# Altium schematic sheet StationSolPortative.SchDoc
size Tabloid
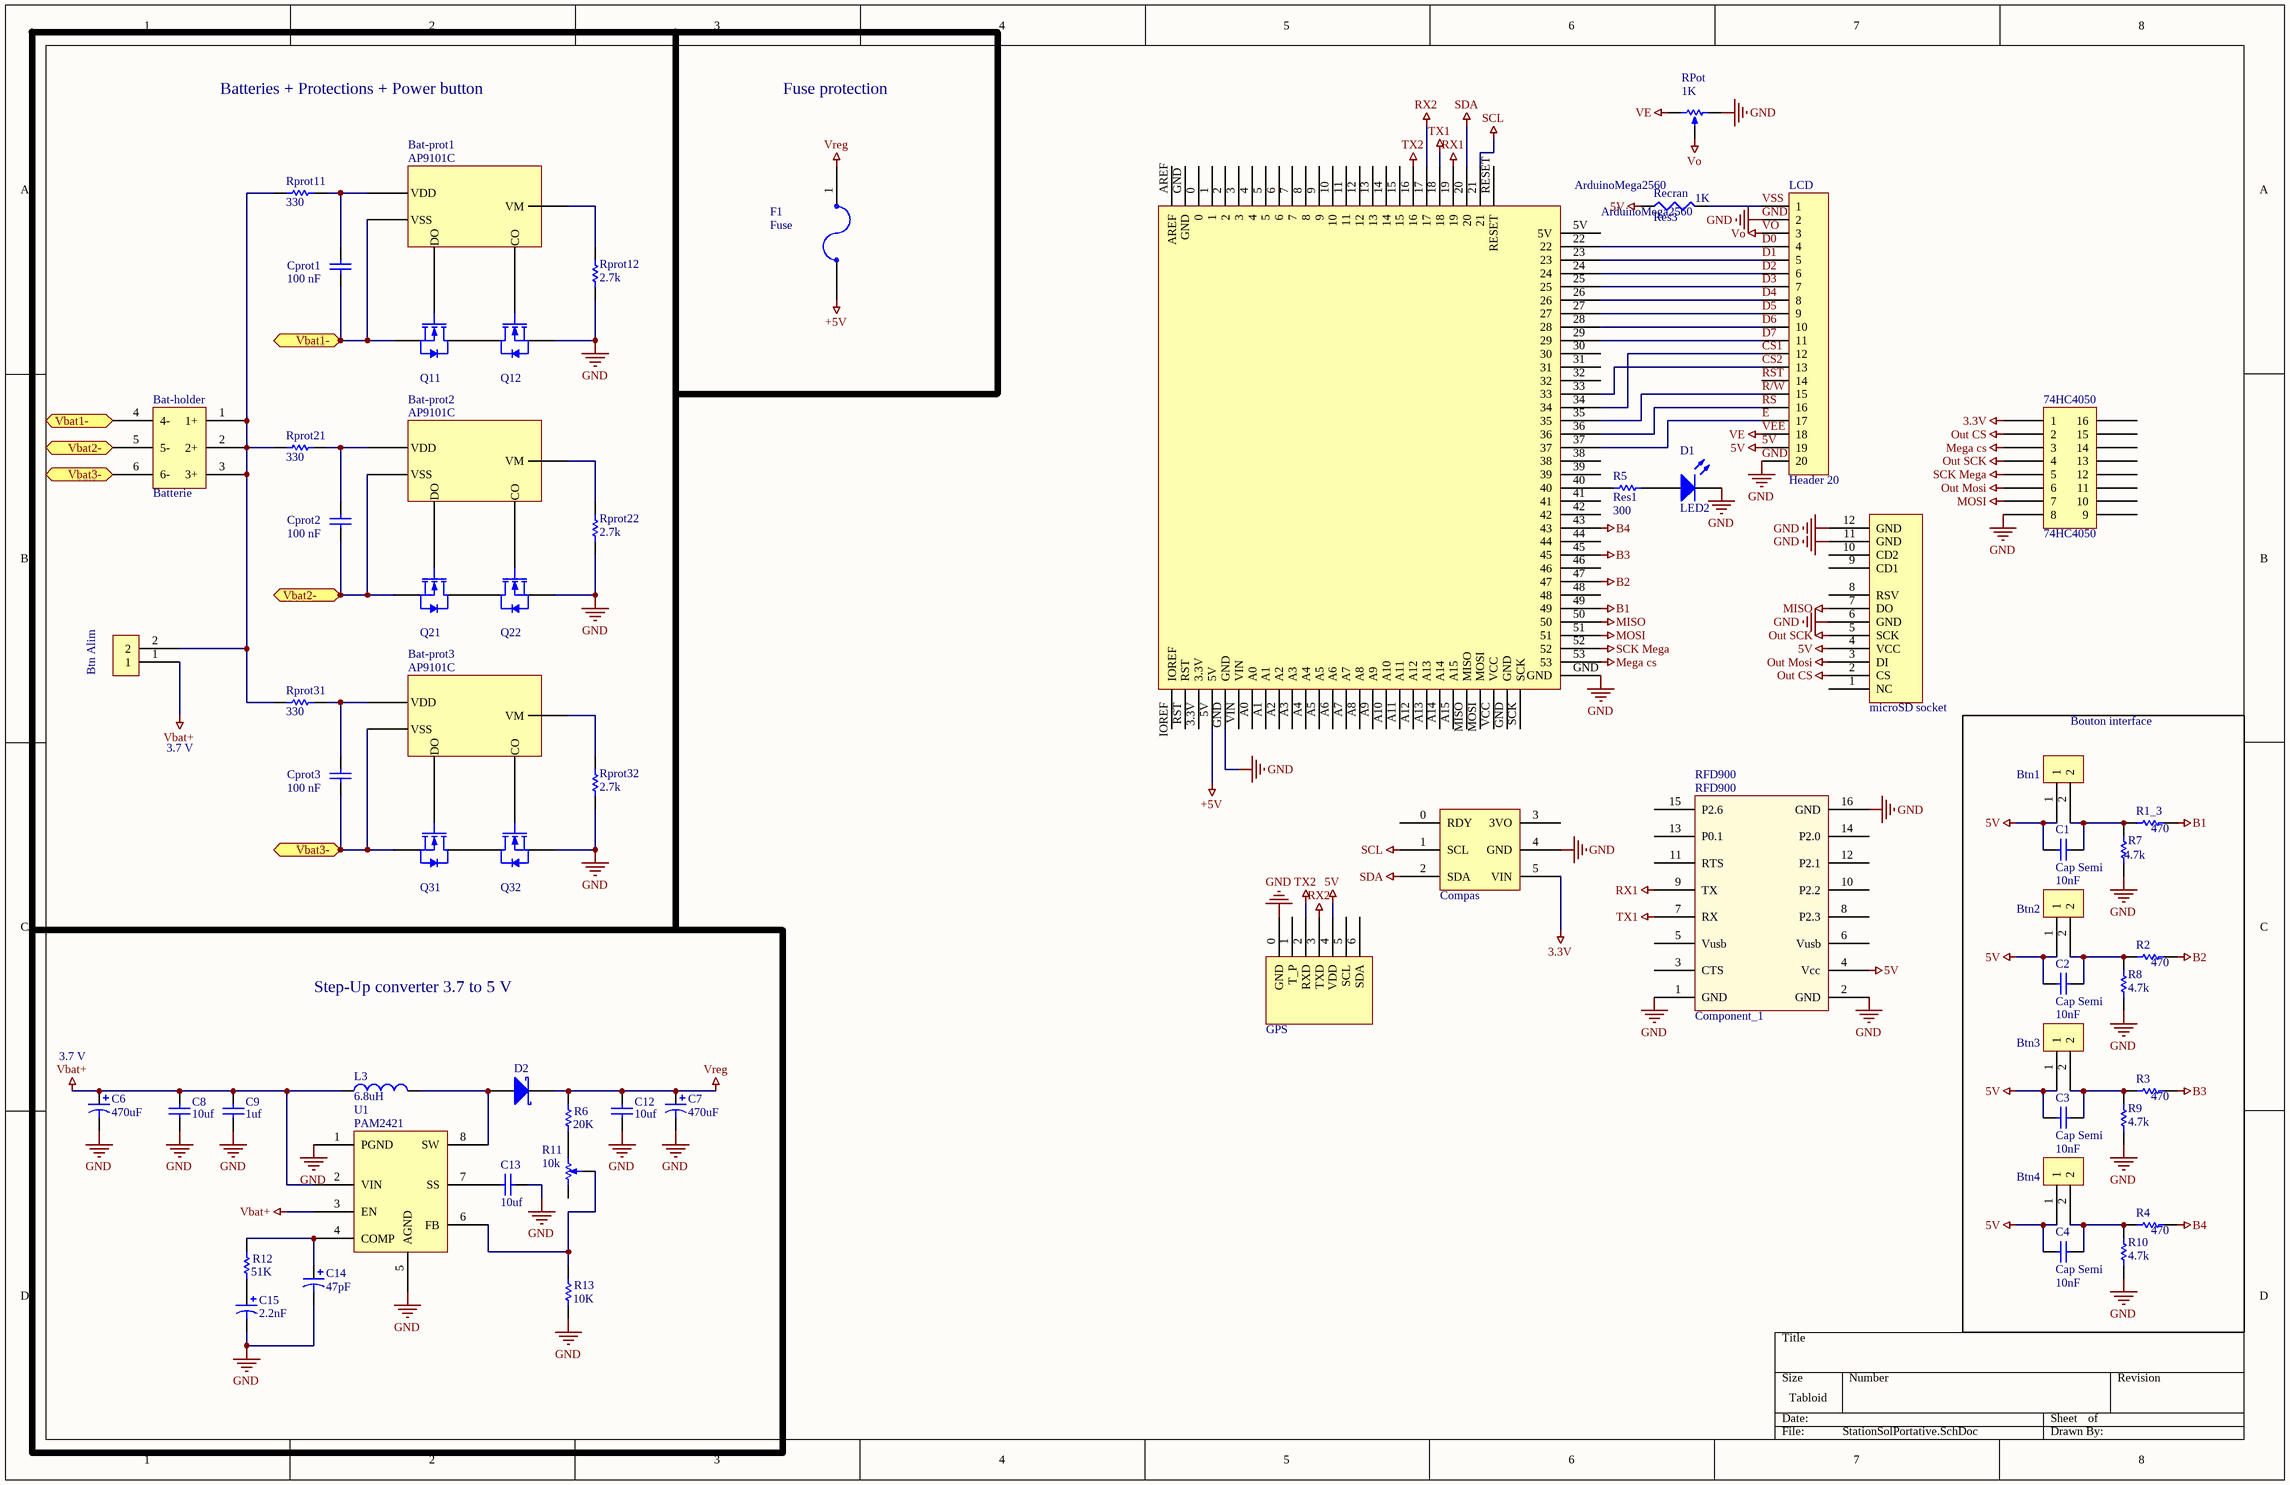
[diagram p0: StationSolPortative.SchDoc]

## Parts
74HC4050  74HC4050  [74hc4050]
?  GPS  [PAM-7Q GPS]
ArduinoMega2560  ArduinoMega2560  [ArduinoMega2560]
Bat-holder  Batterie  [BH-BK-18650-PC6-ND]
Bat-prot1  AP9101C  [SOT26]
Bat-prot2  AP9101C  [SOT26]
Bat-prot3  AP9101C  [SOT26]
Btn1  MAT100_2PINS  [MTA100_2PINS]  (value not drawn)
Btn2  MAT100_2PINS  [MTA100_2PINS]  (value not drawn)
Btn3  MAT100_2PINS  [MTA100_2PINS]  (value not drawn)
Btn4  MAT100_2PINS  [MTA100_2PINS]  (value not drawn)
Btn_Alim  MAT100_2PINS  [MTA100_2PINS]  (value not drawn)
C1  Cap Semi  value 10nF  [Capacité bouton]
C2  Cap Semi  value 10nF  [Capacité bouton]
C3  Cap Semi  value 10nF  [Capacité bouton]
C4  Cap Semi  value 10nF  [Capacité bouton]
C6  value 470uF  [Capacitor 470 uF]  (hidden comment: Cap Pol1)
C7  value 470uF  [Capacitor 470 uF]  (hidden comment: Cap Pol1)
C8  10uf  [CAP 0805 - N]
C9  1uf  [CAP 0805 - N]
C12  10uf  [CAP 0805 - N]
C13  10uf  [CAP 0805 - N]
C14  value 47pF  [CAP 0805 - N]  (hidden comment: Cap Pol1)
C15  value 2.2nF  [CAP 0805 - N]  (hidden comment: Cap Pol1)
Compas  HMC5883L  [HMC5883L]  (value not drawn)
Cprot1  100 nF  [CAP 0805 - N]
Cprot2  100 nF  [CAP 0805 - N]
Cprot3  100 nF  [CAP 0805 - N]
D1  LED2  [3.2X1.6X1.1]
D2  Diode SS34  [Diode]  (value not drawn)
F1  Fuse  [Fuse Holder 3mm]
L3  value 6.8uH  [Inductance 6.8uH]  (hidden comment: Inductor)
LCD  Header 20  [Connector écran]
microSD_socket  microSD socket  [Carte SD]  (value not drawn)
Q11  Mosfet 14A smd  [SON127P630X110-8N]  (value not drawn)
Q12  Mosfet 14A smd  [SON127P630X110-8N]  (value not drawn)
Q21  Mosfet 14A smd  [SON127P630X110-8N]  (value not drawn)
Q22  Mosfet 14A smd  [SON127P630X110-8N]  (value not drawn)
Q31  Mosfet 14A smd  [SON127P630X110-8N]  (value not drawn)
Q32  Mosfet 14A smd  [SON127P630X110-8N]  (value not drawn)
r  RPot  value 1K  [VR5]
R1_3  470  [470  and 4.7k Resistance]
R2  470  [470  and 4.7k Resistance]
R3  470  [470  and 4.7k Resistance]
R4  470  [470  and 4.7k Resistance]
R5  Res1  value 300  [470  and 4.7k Resistance]
R6  value 20K  [Res 0805 - N]  (hidden comment: Res1)
R7  4.7k  [470  and 4.7k Resistance]
R8  4.7k  [470  and 4.7k Resistance]
R9  4.7k  [470  and 4.7k Resistance]
R10  4.7k  [470  and 4.7k Resistance]
R11  10k  [POT4MM-2]
R12  value 51K  [Res 0805 - N]  (hidden comment: Res1)
R13  value 10K  [Res 0805 - N]  (hidden comment: Res1)
Recran  Res3  value 1K  [470  and 4.7k Resistance]
RFD900  Component_1  [RFD900]
Rprot11  value 330  [Res 0805 - N]  (hidden comment: Res smd)
Rprot12  value 2.7k  [Res 0805 - N]  (hidden comment: Res smd)
Rprot21  value 330  [Res 0805 - N]  (hidden comment: Res smd)
Rprot22  value 2.7k  [Res 0805 - N]  (hidden comment: Res smd)
Rprot31  value 330  [Res 0805 - N]  (hidden comment: Res smd)
Rprot32  value 2.7k  [Res 0805 - N]  (hidden comment: Res smd)
U1  PAM2421  [SOP8]

## Blocks framed on the sheet
Batteries + Protections + Power button: Bat-holder Bat-prot1-Bat-prot3 Btn_Alim Cprot1-Cprot3 Q11 Q12 Q21 Q22 Q31 Q32 Rprot11 Rprot12 Rprot21 Rprot22 Rprot31 Rprot32
Fuse protection: F1
Bouton interface: Btn1-Btn4 C1-C4 R1_3 R2-R4 R7-R10
Step-Up converter 3.7 to 5 V: C6-C9 C12-C15 D2 L3 R6 R11-R13 U1

## Ports
Vbat1-, Vbat2-, Vbat3-

## Nets
3.3V: 74HC4050.1 Compas.5(VIN)
5V: ?.4(VDD) Btn1.1 Btn2.1 Btn3.1 Btn4.1 C1.1 C2.1 C3.1 C4.1 LCD.19 microSD_socket.4(VCC) Recran.1 RFD900.4(Vcc)
+5V: ArduinoMega2560.5V F1.2
B1: ArduinoMega2560.49 R1_3.2
B2: ArduinoMega2560.47 R2.2
B3: ArduinoMega2560.45 R3.2
B4: ArduinoMega2560.43 R4.2
GND: 74HC4050.8 ?.0(GND) ArduinoMega2560.GND C6.2 C7.2 C8.1 C9.1 C12.1 C13.1 C14.2 C15.2 Compas.4(GND) D1.2(K) LCD.2 LCD.20 microSD_socket.6(GND) microSD_socket.11(GND) microSD_socket.12(GND) Q12.S Q22.S Q32.S r.2(BOT) R7.2 R8.2 R9.2 R10.2 R13.1 RFD900.1(GND) RFD900.2(GND) RFD900.16(GND) Rprot12.1 Rprot22.1 Rprot32.1 U1.1(PGND) U1.5(AGND)
Mega cs: 74HC4050.3 ArduinoMega2560.53
MISO: ArduinoMega2560.50 microSD_socket.7(DO)
MOSI: 74HC4050.7 ArduinoMega2560.51
Out CS: 74HC4050.2 microSD_socket.2(CS)
Out Mosi: 74HC4050.6 microSD_socket.3(DI)
Out SCK: 74HC4050.4 microSD_socket.5(SCK)
RX1: ArduinoMega2560.19 RFD900.9(TX)
RX2: ?.3(TXD) ArduinoMega2560.17
SCK Mega: 74HC4050.5 ArduinoMega2560.52
SCL: ArduinoMega2560.21 Compas.1(SCL)
SDA: ArduinoMega2560.20 Compas.2(SDA)
TX1: ArduinoMega2560.18 RFD900.7(RX)
TX2: ?.2(RXD) ArduinoMega2560.16
Vbat+: Btn_Alim.1 C6.1 C8.2 C9.2 L3.1 U1.2(VIN) U1.3(EN)
VEE: LCD.18 r.1(TOP)  [also labelled VE]
VO: LCD.3 r.3(TAP)
Vreg: C7.1 C12.2 D2.1(K) F1.1 R6.2
CS1: ArduinoMega2560.34 LCD.12
CS2: ArduinoMega2560.33 LCD.13
D0: ArduinoMega2560.22 LCD.4
D1: ArduinoMega2560.23 LCD.5
D2: ArduinoMega2560.24 LCD.6
D3: ArduinoMega2560.25 LCD.7
D4: ArduinoMega2560.26 LCD.8
D5: ArduinoMega2560.27 LCD.9
D6: ArduinoMega2560.28 LCD.10
D7: ArduinoMega2560.29 LCD.11
E: ArduinoMega2560.37 LCD.17
R/W: ArduinoMega2560.35 LCD.15
RS: ArduinoMega2560.36 LCD.16
RST: LCD.14
Vbat1-: Bat-holder.4(4-) Bat-prot1.VSS Cprot1.1 Q11.S ; port Vbat1-
Vbat2-: Bat-holder.5(5-) Bat-prot2.VSS Cprot2.1 Q21.S ; port Vbat2-
Vbat3-: Bat-holder.6(6-) Bat-prot3.VSS Cprot3.1 Q31.S ; port Vbat3-
VSS: LCD.1 Recran.2
NetArduinoMega2560_40: ArduinoMega2560.40 R5.1
NetBat-holder_1: Bat-holder.1(1+) Bat-holder.2(2+) Bat-holder.3(3+) Btn_Alim.2 Rprot11.1 Rprot21.1 Rprot31.1
NetBat-prot1_CO: Bat-prot1.CO Q12.G
NetBat-prot1_DO: Bat-prot1.DO Q11.G
NetBat-prot1_VDD: Bat-prot1.VDD Cprot1.2 Rprot11.2
NetBat-prot1_VM: Bat-prot1.VM Rprot12.2
NetBat-prot2_CO: Bat-prot2.CO Q22.G
NetBat-prot2_DO: Bat-prot2.DO Q21.G
NetBat-prot2_VDD: Bat-prot2.VDD Cprot2.2 Rprot21.2
NetBat-prot2_VM: Bat-prot2.VM Rprot22.2
NetBat-prot3_CO: Bat-prot3.CO Q32.G
NetBat-prot3_DO: Bat-prot3.DO Q31.G
NetBat-prot3_VDD: Bat-prot3.VDD Cprot3.2 Rprot31.2
NetBat-prot3_VM: Bat-prot3.VM Rprot32.2
NetBtn1_2: Btn1.2 C1.2 R1_3.1 R7.1
NetBtn2_2: Btn2.2 C2.2 R2.1 R8.1
NetBtn3_2: Btn3.2 C3.2 R3.1 R9.1
NetBtn4_2: Btn4.2 C4.2 R4.1 R10.1
NetC13_2: C13.2 U1.7(SS)
NetC14_1: C14.1 R12.2 U1.4(COMP)
NetC15_1: C15.1 R12.1
NetD1_1: D1.1(A) R5.2
NetD2_3: D2.3(A) L3.2 U1.8(SW)
NetQ11_D: Q11.D Q12.D
NetQ21_D: Q21.D Q22.D
NetQ31_D: Q31.D Q32.D
NetR6_1: R6.1 R11.CW(+)
NetR11_W: R11.W R13.2 U1.6(FB)

Not connected (* = marked no-connect by the designer): 74HC4050 9 10 11 12 13 14 15 16; ? 1(T_P) 5(SCL) 6(SDA); ArduinoMega2560 0 1 2 3 3.3V 4 5 6 7 8 9 10 11 12 13 14 15 30 31 32 38 39 41 42 44 46 48 A0 A1 A2 A3 A4 A5 A6 A7 A8 A9 A10 A11 A12 A13 A14 A15 AREF IOREF MISO MOSI RESET RST SCK VCC VIN; Compas 0(RDY) 3(3VO); microSD_socket 1(NC) 8(RSV) 9(CD1) 10(CD2); R11 CCW(-); RFD900 3(CTS) 5(Vusb) 6(Vusb) 8(P2.3) 10(P2.2) 11(RTS) 12(P2.1) 13(P0.1) 14(P2.0) 15(P2.6)

## Notes on the sheet
- 3.7 V
- (near C6) 3.7 V

## Library data of the parts
? = Pam-Q7 GPS
Bat-holder = BH-BK-18650-PC6-ND
Bat-prot1-Bat-prot3 = AP9101C: pin to pad: CO>3 DO>1 VDD>5 VM>2 VSS>6; NAME: AP9101C
C1-C4 = Cap Semi: Capacitor (Semiconductor SIM Model); Published: 8-Jun-2000; LatestRevisionDate: 29-May-2009; LatestRevisionNote: IPC-7351 Footprint Added.; PackageReference: C1206; Publisher: Altium Limited; PackageDescription: Chip Capacitor
C6 C7 C14 C15 = Cap Pol1: Polarized Capacitor (Radial); Published: 8-Jun-2000; LatestRevisionDate: 17-Jul-2002; LatestRevisionNote: Re-released for DXP Platform.; PackageReference: RB7.6-15; Publisher: Altium Limited; PackageDescription: Polarized Capacitor (Radial); 2 Leads
C8 C9 C12 C13 Cprot1-Cprot3 = Condensateur smd: Value: 5 pF
Compas = HMC5883L: Compass
D1 = LED2: Typical RED, GREEN, YELLOW, AMBER GaAs LED; Published: 8-Jun-2000; LatestRevisionDate: 17-Jul-2002; LatestRevisionNote: Re-released for DXP Platform.; PackageReference: 3.2X1.6X1.1; Publisher: Altium Limited; PackageDescription: SM LED; 2 Flat Leads; PackageVersion: Feb-2002
D2 = Diode 10TQ035: Schottky Rectifier; Note: Terminal 2 is the TAB and is electrically connected to the cathode; Published: 8-Jun-2000; LatestRevisionDate: 17-Jul-2002; LatestRevisionNote: Re-released for DXP Platform.; DatasheetVersion: PD-2.057B; PackageVersion: Feb-1998; PackageReference: TO-220AC; Publisher: Altium Limited; PackageDescription: TO, Thru-Hole, Vertical, Heatsink Mounted; 3 In-Line Leads (1 Absent); Pitch 2.54 mm; ComponentLink1Description: Manufacturer Link; ComponentLink1URL: http://www.irf.com/; ComponentLink2Description: Datasheet; ComponentLink2URL: http://www.irf.com/product-info/datasheets/data/10tq.pdf
L3 = Inductor: Code_IEC: 1005; Published: 8-Jun-2000; LatestRevisionDate: 29-May-2009; LatestRevisionNote: IPC-7351 Footprint Added.; PackageReference: 0402-A; Publisher: Altium Limited; PackageDescription: Chip Inductor; Code_JEITA: 0402
LCD = Header 20: Header, 20-Pin; LatestRevisionDate: 17-Jul-2002; LatestRevisionNote: Re-released for DXP Platform.; Publisher: Altium Limited
Q11 Q12 Q21 Q22 Q31 Q32 = CSD16412Q5A: Mosfet 14A
r = RPot: Potentiometer; Sim Note: Enter the Resistance value and the set point into parameter fields.; Set Position: 0.5; Published: 8-Jun-2000; LatestRevisionDate: 17-Jul-2002; LatestRevisionNote: Re-released for DXP Platform.; PackageReference: VR5; Publisher: Altium Limited; PackageDescription: Variable Resistor, Thru-Hole; 3 Leads
R1_3 R2-R10 R12 R13 = Res1: Resistor; Published: 8-Jun-2000; LatestRevisionDate: 17-Jul-2002; LatestRevisionNote: Re-released for DXP Platform.; PackageReference: AXIAL-0.3; Publisher: Altium Limited; PackageDescription: Axial Device, Thru-Hole; 2 Leads; 0.3 in Pin Spacing
  R1_3 R2-R4: Value: 470
  R7-R10: Value: 4.7K
R11 = RPot SM: Square Trimming Potentiometer; Published: 17-Dec-2003; DatasheetVersion: Oct-2003; PackageReference: POT4MM-2; Publisher: Altium Limited; PackageDescription: Square Trimming Potentiometer; ComponentLink1Description: Manufacturer Link; ComponentLink1URL: http://bourns.com/2/search.html
Recran = Res3: Resistor; Published: 8-Jun-2000; LatestRevisionDate: 29-May-2009; LatestRevisionNote: IPC-7351 Footprint Added.; PackageReference: J1-0603; Publisher: Altium Limited; PackageDescription: Chip Resistor
U1 = PAM2421: 3A PWM STEP-UP DC-DC CONVERTER